# Altium schematic sheet I2C_Isolator.SchDoc
size A4; SheetNumber: 2; SheetTotal: 16
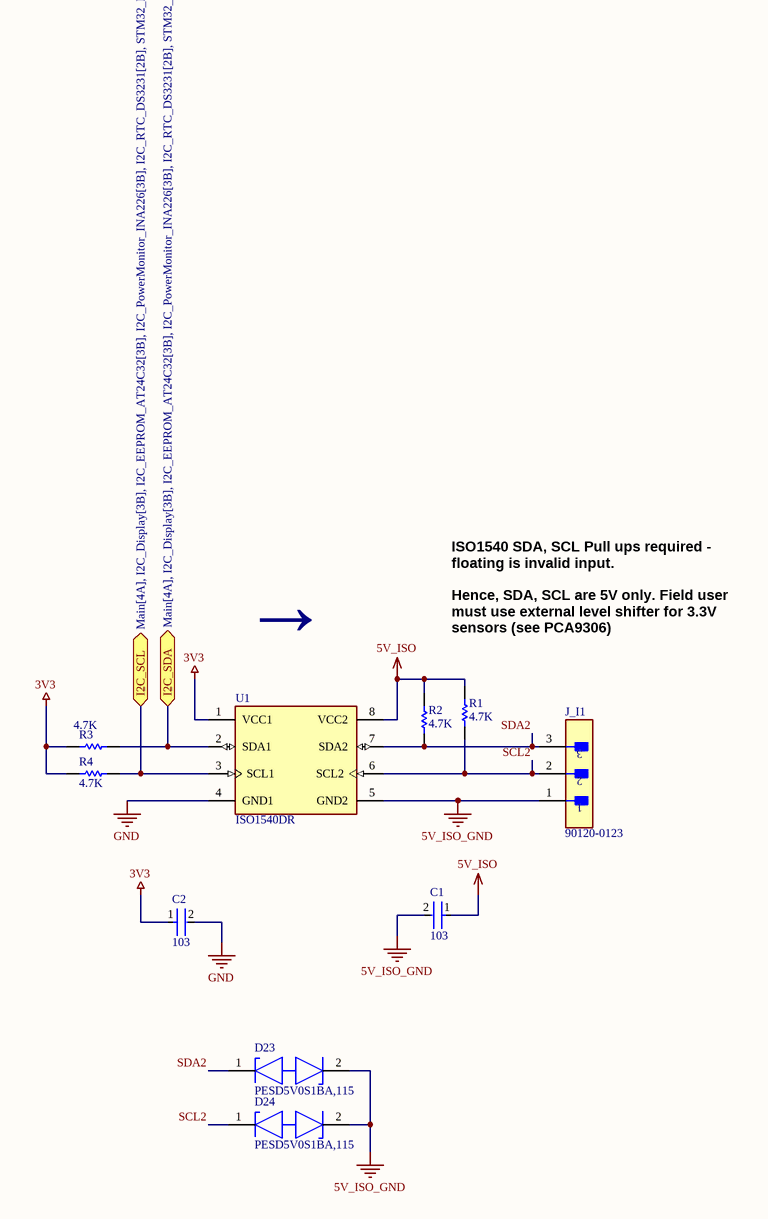
[diagram p0: I2C_Isolator.SchDoc]

## Parts
C1  103  [FP-CC0603-DA-MFG]
C2  103  [FP-CC0603-DA-MFG]
D23  PESD5V0S1BA,115  [FP-SOD323-CA-MFG]
D24  PESD5V0S1BA,115  [FP-SOD323-CA-MFG]
J_I1  90120-0123  [FP-90120-0123-MFG]
R1  4.7K  [RESC1608X55X25ML10T15]
R2  4.7K  [RESC1608X55X25ML10T15]
R3  4.7K  [RESC1608X55X25ML10T15]
R4  4.7K  [RESC1608X55X25ML10T15]
U1  ISO1540DR  [FP-D0008A-MFG]

## Ports
I2C_SCL (bidir, see Main[4A], I2C_Display[3B], I2C_EEPROM_AT24C32[3B], I2C_PowerMonitor_INA226[3B], I2C_RTC_DS3231[2B], STM32_MCU[8B]), I2C_SDA (bidir, see Main[4A], I2C_Display[3B], I2C_EEPROM_AT24C32[3B], I2C_PowerMonitor_INA226[3B], I2C_RTC_DS3231[2B], STM32_MCU[8B])

## Nets
3V3: C2.1 R3.2 R4.2 U1.1(VCC1)
5V_ISO: C1.1 R1.2 R2.2 U1.8(VCC2)
5V_ISO_GND: C1.2 D23.2(K2) D24.2(K2) J_I1.1 U1.5(GND2)
GND: C2.2 U1.4(GND1)
I2C_SCL: R4.1 U1.3(SCL1) ; port I2C_SCL
I2C_SDA: R3.1 U1.2(SDA1) ; port I2C_SDA
SCL2: D24.1(K1) J_I1.2 R1.1 U1.6(SCL2)
SDA2: D23.1(K1) J_I1.3 R2.1 U1.7(SDA2)

## Notes on the sheet
- →
- ISO1540 SDA, SCL Pull ups required - floating is invalid input.
  Hence, SDA, SCL are 5V only. Field user must use external level shifter for 3.3V sensors (see PCA9306)

## Library data of the parts
C1 C2 = CMP-2000-05002-2: CAP CER 0.1UF 16V X7R 0603; Manufacturer Part Number: CC0603KRX7R7BB104; Manufacturer: YAGEO; Tolerance: 0.1; Value: 100 nF; Temperature Coefficient: 15%; Material: Ceramic; Voltage Rating: 16 V; Package: CC0603-DA; ComponentLink2Description: Datasheet; Octopart: https://octopart.com/cc0603krx7r7bb104-yageo-192941; Temperature Range High: +125°C; Digikey Description: CAP CER 0.1UF 16V X7R 0603; Voltage: 16 V; Device Class L2: Capacitors; Height: 0.9mm; Temperature: -55°C to +125°C; Device Class L1: Passive Components; Device Class L3: Ceramic Capacitors; ComponentLink2URL: http://www.yageo.com/documents/recent/UPY-GPHC_X7R_6.3V-to-50V_18.pdf; Footprint Url: http://www.yageo.com/exep/pages/download/literatures/UPY-C_GEN_24.pdf; RoHS: TRUE; Temperature Range Low: -55°C; Temperature Characteristic: X7R; Lead Free: Yes; Capacitance: 100 nF; Category: Cap; Mouser Description: Multilayer Ceramic Capacitor, CC Series, 0.1 - F, - 10%, X7R, 16 V, 0603 [1608 Metric]; Automotive: No
D23 D24 = CMP-14432-000001-1: TVS DIODE 5V 14V SOD323
J_I1 = CMP-04776-000237-1: CONN HEADER VERT 3POS 2.54MM; Number of Circuits: 3; Max Voltage Rating (DC): 350.35kV; Contact Resistance: 20mR; Gender: Male; Voltage Rating (AC): 350V; Glow Wire Compliant: Non-compliant; Current Rating: 3A; Contact Post Length: 2.9mm; Number of Contacts: 3; Number of Rows: 1; Max Operating Temperature: 125°C; Orientation: Vertical; Number of Positions: 3; Packaging: Tray; Contact Mating Length: 6.75mm; Housing Color: Black; Termination: Solder; Contact Material: Brass; Radiation Hardening: No; Lead Free: Lead Free; Pitch: 2.54mm; RoHS Compliant: Yes; Voltage Rating: 350V; Contact Plating: Tin; Color: Black; Min Operating Temperature: -55°C; Mount: Through Hole; Housing Material: Polyester; Series: 90120; Contact Gender: Male; REACH SVHC: No SVHC
R1-R4 = CMP-2000-05024-1: Chip Resistor, 4.7 KOhm, +/- 5%, 100 mW, -55 to 155 degC, 0603 (1608 Metric), RoHS, Tape and Reel; Manufacturer: Yageo; Resistance: 4.7kOhms; Temperature Coefficient: 100PPM/C; Power Rating: 100mW; Voltage Rating: 50V; Operating Temperature Range: -55Cto+155C; Case Code - mm: 1608; Tolerance: 5%; Product: ThickFilmResistorsGeneralPurpose; Case Code - in: 0603; Datasheet URL: http://www.yageo.com/documents/recent/PYu-RC_Group_51_RoHS_L_04.pdf; Package Reference: 603; Datasheet Version: Rev. 4, 02/2016; Package Description: 2-Pin Surface Mount Device, Body 1.6 x 0.8 mm; Manufacturer URL: http://www.yageo.com/; Series: RC; Packaging: Reel; Termination Style: SMD/SMT
U1 = CMP-04872-000011-1: DGTL ISO 2.5KV 2CH I2C 8SOIC; Manufacturer: Texas Instruments; Max Supply Voltage: 5.5V; Interface: I2C,SMBus,Other; Nominal Supply Current: 1.7-3.1mA; Standoff Height: 0.11mm; Max Junction Temp: +136°C; Min Supply Voltage: 3V; Ipc Land Pattern Name: SOIC127P600X175-8; Ambient Temperature Range Low: -40°C; Temperature: -40°C to +125°C; Device Class L3: unset; Mouser Description: Digital Isolators Low-Power,Bidirec I2C Iso; Manufacturer Part Number: ISO1540DR; Octopart: https://octopart.com/iso1540dr-texas+instruments-24334113; Digikey Description: DGTL ISO 2.5KV 2CH I2C 8SOIC; Category: IC; Height: 1.75mm; Ambient Temperature Range High: +125°C; RoHS: TRUE; Automotive: No; Package: D0008A; ComponentLink2URL: http://www.ti.com/lit/ds/symlink/iso1540.pdf; Device Class L2: Interface ICs; Device Class L1: Integrated Circuits (ICs); Temperature Range Low: -40°C; Lead Free: Yes; ComponentLink2Description: Datasheet; Temperature Range High: +125°C